# Altium schematic sheet TMC2160_Driver.SchDoc
size 420 x 297 mm; SheetNumber: 2; SheetTotal: 2
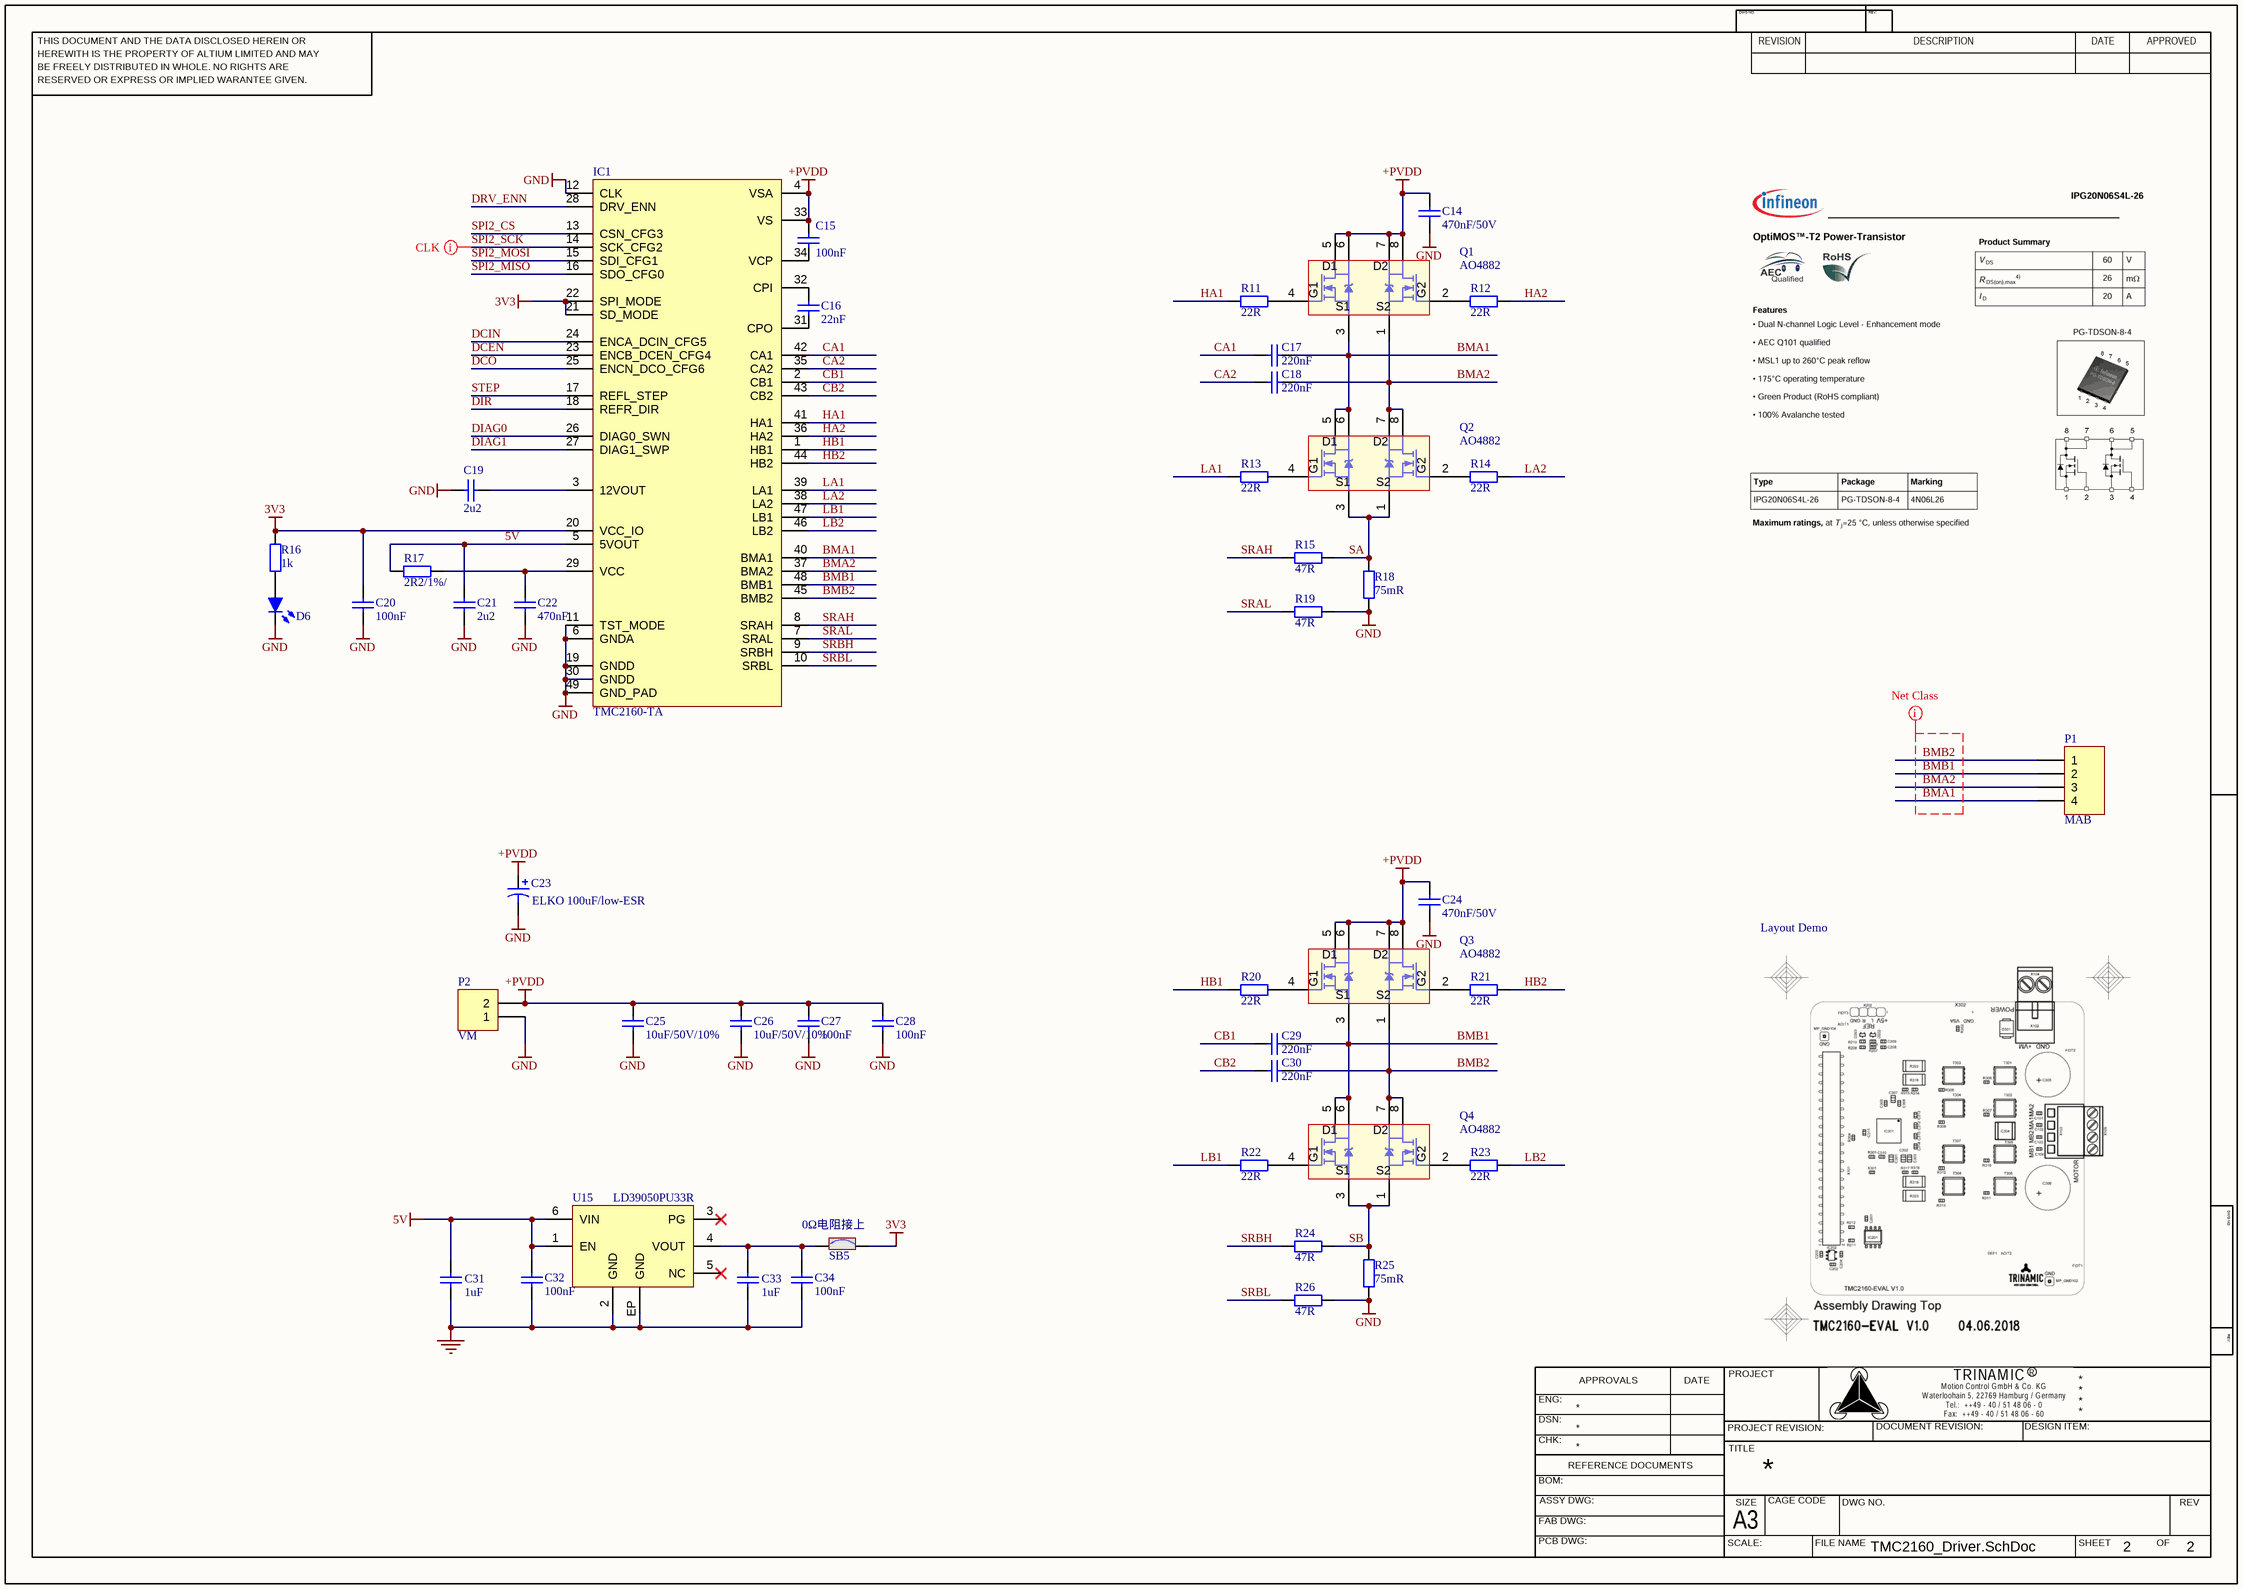
[diagram p0: TMC2160_Driver.SchDoc]

## Parts
C14  470nF/50V  [C0603]
C15  100nF  [C0603]
C16  22nF  [C0603]
C17  220nF  [C0603]
C18  220nF  [C0603]
C19  2u2  [C0603]
C20  100nF  [C0603]
C21  2u2  [C0603]
C22  470nF  [C0603]
C23  value ELKO 100uF/low-ESR  [EXT_POL_CAP]  (hidden comment: Cap Pol1)
C24  470nF/50V  [C0603]
C25  10uF/50V/10%  [C1206]
C26  10uF/50V/10%  [C1206]
C27  100nF  [C0603]
C28  100nF  [C0603]
C29  220nF  [C0603]
C30  220nF  [C0603]
C31  value 1uF  [C0603]
C32  value 100nF  [C0402]
C33  value 1uF  [C0603]
C34  value 100nF  [C0402]
D6  LED, Blue, SMD, 20mA, 2.8V, 465 nm  [LED_0603]  (value not drawn)
IC1  TMC2160-TA  [TMC5160_TSQFP50P900X900X120_HS-49L]
P1  MAB  [4_PIN_THT_1mm_hole]
P2  VM  [2_PIN_THT]
Q1  AO4882  [TDSON-8-4_IPG20N06S4L26]
Q2  AO4882  [TDSON-8-4_IPG20N06S4L26]
Q3  AO4882  [TDSON-8-4_IPG20N06S4L26]
Q4  AO4882  [TDSON-8-4_IPG20N06S4L26]
R11  Resistance: 22R  [R0603]  (hidden comment: 22R / 100mW / 1%)
R12  Resistance: 22R  [R0603]  (hidden comment: 22R / 100mW / 1%)
R13  Resistance: 22R  [R0603]  (hidden comment: 22R / 100mW / 1%)
R14  Resistance: 22R  [R0603]  (hidden comment: 22R / 100mW / 1%)
R15  Resistance: 47R  [R0603]  (hidden comment: 47R /  / 1%)
R16  1k  [R0603]
R17  2R2/1%/  [R0603]
R18  75mR  [R1206]
R19  Resistance: 47R  [R0603]  (hidden comment: 47R /  / 1%)
R20  Resistance: 22R  [R0603]  (hidden comment: 22R / 100mW / 1%)
R21  Resistance: 22R  [R0603]  (hidden comment: 22R / 100mW / 1%)
R22  Resistance: 22R  [R0603]  (hidden comment: 22R / 100mW / 1%)
R23  Resistance: 22R  [R0603]  (hidden comment: 22R / 100mW / 1%)
R24  Resistance: 47R  [R0603]  (hidden comment: 47R /  / 1%)
R25  75mR  [R1206]
R26  Resistance: 47R  [R0603]  (hidden comment: 47R /  / 1%)
SB5  (no value)  [SOLDER-BRIDGE_R0603-0R]
U15  value LD39050PU33R  [ICC_DFN6-EPAD_3X3_P095]

## Nets
3V3: C20.1 IC1.20(VCC_IO) IC1.21(SD_MODE) IC1.22(SPI_MODE) R16.1 SB5.2
5V: C21.1 C31.2 C32.2 IC1.5(5VOUT) R17.1 U15.1(EN) U15.6(VIN)
+PVDD: C14.1 C15.1 C23.1 C24.1 C25.2 C26.2 C27.1 C28.1 IC1.4(VSA) IC1.33(VS) P2.2 Q1.5(D1) Q1.6(D1) Q1.7(D2) Q1.8(D2) Q3.5(D1) Q3.6(D1) Q3.7(D2) Q3.8(D2)
GND: C14.2 C19.1 C20.2 C21.2 C22.2 C23.2 C24.2 C25.1 C26.1 C27.2 C28.2 C31.1 C32.1 C33.1 C34.1 D6.2(K) IC1.6(GNDA) IC1.11(TST_MODE) IC1.12(CLK) IC1.19(GNDD) IC1.30(GNDD) IC1.49(GND_PAD) P2.1 R18.2 R19.1 R25.2 R26.1 U15.2(GND) U15.EP(GND)
BMA1: C17.2 IC1.40(BMA1) P1.4 Q1.3(S1) Q2.5(D1) Q2.6(D1)
BMA2: C18.2 IC1.37(BMA2) P1.3 Q1.1(S2) Q2.7(D2) Q2.8(D2)
BMB1: C29.2 IC1.48(BMB1) P1.2 Q3.3(S1) Q4.5(D1) Q4.6(D1)
BMB2: C30.2 IC1.45(BMB2) P1.1 Q3.1(S2) Q4.7(D2) Q4.8(D2)
CA1: C17.1 IC1.42(CA1)
CA2: C18.1 IC1.35(CA2)
CB1: C29.1 IC1.2(CB1)
CB2: C30.1 IC1.43(CB2)
DCEN: IC1.23(ENCB_DCEN_CFG4)
DCIN: IC1.24(ENCA_DCIN_CFG5)
DCO: IC1.25(ENCN_DCO_CFG6)
DIAG0: IC1.26(DIAG0_SWN)
DIAG1: IC1.27(DIAG1_SWP)
DIR: IC1.18(REFR_DIR)
DRV_ENN: IC1.28(DRV_ENN)
HA1: IC1.41(HA1) R11.2
HA2: IC1.36(HA2) R12.1
HB1: IC1.1(HB1) R20.2
HB2: IC1.44(HB2) R21.1
LA1: IC1.39(LA1) R13.2
LA2: IC1.38(LA2) R14.1
LB1: IC1.47(LB1) R22.2
LB2: IC1.46(LB2) R23.1
SA: Q2.1(S2) Q2.3(S1) R15.1 R18.1
SB: Q4.1(S2) Q4.3(S1) R24.1 R25.1
SPI2_CS: IC1.13(CSN_CFG3)
SPI2_MISO: IC1.16(SDO_CFG0)
SPI2_MOSI: IC1.15(SDI_CFG1)
SPI2_SCK: IC1.14(SCK_CFG2)
SRAH: IC1.8(SRAH) R15.2
SRAL: IC1.7(SRAL) R19.2
SRBH: IC1.9(SRBH) R24.2
SRBL: IC1.10(SRBL) R26.2
STEP: IC1.17(REFL_STEP)
NetC15_2: C15.2 IC1.34(VCP)
NetC16_1: C16.1 IC1.31(CPO)
NetC16_2: C16.2 IC1.32(CPI)
NetC19_2: C19.2 IC1.3(12VOUT)
NetC22_1: C22.1 IC1.29(VCC) R17.2
NetC33_2: C33.2 C34.2 SB5.1 U15.4(VOUT)
NetD6_1: D6.1(A) R16.2
NetQ1_2: Q1.2(G2) R12.2
NetQ1_4: Q1.4(G1) R11.1
NetQ2_2: Q2.2(G2) R14.2
NetQ2_4: Q2.4(G1) R13.1
NetQ3_2: Q3.2(G2) R21.2
NetQ3_4: Q3.4(G1) R20.1
NetQ4_2: Q4.2(G2) R23.2
NetQ4_4: Q4.4(G1) R22.1

Not connected (* = marked no-connect by the designer): U15 3(PG)* 5(NC)*

## Layout directives
net class MotorPowerOut: BMA1, BMA2, BMB1, BMB2
mark named CLK: SPI2_SCK

## Notes on the sheet
- Layout Demo
- (near SB5) 0Ω电阻接上
- THIS DOCUMENT AND THE DATA DISCLOSED HEREIN OR
- HEREWITH IS THE PROPERTY OF ALTIUM LIMITED AND MAY
- DWG NO:
- REVISION
- REV:
- DESCRIPTION
- DATE
- APPROVED
- BE FREELY DISTRIBUTED IN WHOLE. NO RIGHTS ARE
- RESERVED OR EXPRESS OR IMPLIED WARANTEE GIVEN.
- ENG:
- APPROVALS
- PROJECT
- DSN:
- CHK:
- REFERENCE DOCUMENTS
- PROJECT REVISION:
- TITLE
- DOCUMENT REVISION:
- DESIGN ITEM:
- BOM:
- FAB DWG:
- PCB DWG:
- ASSY DWG:
- SCALE:
- A3
- SIZE
- CAGE CODE
- FILE NAME
- DWG NO.
- SHEET
- OF
- REV

## Library data of the parts
C14 = 0.47 µF, 50 V, ± 10%, X7R, C Series: SMD Multilayer Ceramic Capacitor, 0603 [1608 Metric], 0.47 µF, 50 V, ± 10%, X7R, C Series; MPN: C1608X7R1H474K080AC; Type: MLCC; VoltageRating: 50V; ComponentLinknDescription: Datasheet; MF: TDK; Capacitance: 470nF; Characteristic: *; ComponentLinknURL: *; Precision: 10%
C15 C20 = Capacitor: Ceramic capacitor; MPN: MC0603F104M500CT; Type: MLCC; Voltage rating: 50V; ComponentLinknDescription: Datasheet; MF: Multicomp; Precision: 20%; Characteristic: *; ComponentLinknURL: *; Capacitance: 100nF
C16 = Capacitor: Ceramic capacitor; MPN: MC0603B223K500CT; Type: MLCC; Voltage rating: 50V; ComponentLinknDescription: Datasheet; MF: Multicomp; Precision: 20%; Characteristic: *; ComponentLinknURL: *; Capacitance: 22nF
C17 C18 C29 C30 = 0.22 µF, 50 V, ± 10%, X7R: SMD Multilayer Ceramic Capacitor, 0603 [1608 Metric], 0.22 µF, 50 V, ± 10%, X7R, GCM Series; MPN: GCM188R71H224KA64D; Type: MLCC; Voltage rating: 50V; ComponentLinknDescription: Datasheet; MF: MURATA; Characteristic: *; ComponentLinknURL: *; Capacitance: 220nF; Precision: 10%
C19 C21 = 2.2 µF, 25 V, ± 10%, X5R, GRM Series: SMD Multilayer Ceramic Capacitor, 0603 [1608 Metric], 2.2 µF, 25 V, ± 10%, X5R, GRM Series; MPN: GRM188R61E225KA12D; Type: MLCC; Voltage rating: 50V; ComponentLinknDescription: Datasheet; MF: MURATA; Characteristic: *; ComponentLinknURL: *; Capacitance: 2u2; Precision: 10%
C22 = Capacitor: Ceramic capacitor; MPN: MC0603X474K160CT; Type: MLCC; Voltage rating: 16V; ComponentLinknDescription: Datasheet; MF: Multicomp; Precision: 10%; Characteristic: *; ComponentLinknURL: *; Capacitance: 470nF
C23 = Cap Pol1: Polarized Capacitor (Radial); Published: 8-Jun-2000; LatestRevisionDate: 17-Jul-2002; LatestRevisionNote: Re-released for DXP Platform.; PackageReference: RB7.6-15; Publisher: Altium Limited; PackageDescription: Polarized Capacitor (Radial); 2 Leads
C24 = 0.47 µF, 50 V, ± 10%, X7R, C Series: SMD Multilayer Ceramic Capacitor, 0603 [1608 Metric], 0.47 µF, 50 V, ± 10%, X7R, C Series; MPN: C1608X7R1H474K080AC; Type: MLCC; ComponentLinknDescription: Datasheet; MF: TDK; Capacitance: 470nF; VoltageRating: 50V; Characteristic: *; ComponentLinknURL: *; Precision: 10%
C25 C26 = 10 µF, 50 V, ± 20%, X5R, GRM Series: SMD Multilayer Ceramic Capacitor, 1206 [3216 Metric], 10 µF, 50 V, ± 20%, X5R, GRM Series; MPN: GRM31CR61H106MA12L; Type: MLCC; VoltageRating: 50V; ComponentLinknDescription: Datasheet; MF: MURATA; Capacitance: 10uF; Precision: 10%; Characteristic: *; ComponentLinknURL: *
C27 C28 = Capacitor: Ceramic capacitor; Manufacturer: Multicomp; MPN: MC0603F104M500CT; Type: MLCC; Voltage rating: 50V; ComponentLinknDescription: Datasheet; Precision: 20%; Characteristic: *; ComponentLinknURL: *; Capacitance: 100nF
C31 C33 = MCD-00010: Capacitor, MLCC, 1uF, 16V, X5R, 10%, 0603, T=0,8mm; Manufacturer_Part_Number: CC0603KRX5R7BB105; Manufacturer: YAGEO; Provided_By: Subcon; Initial_Board_Reference: MB1274; Internal_Part_Number: MCD-00010; Status: Released; Package: C0603; ComponentLink1Description: Yageo_Capacitor_X5R-series.pdf; ECCN_US: n/a; ECCN_EU: n/a; Part_Type: Capacitor; ComponentLink1URL: http://tunmcdsvn.tun.st.com/Component_Datasheet_Library/Trunk/Capacitors/Yageo_Multilayer_capacitor_X5R_series_100pF_to_100uF
C32 C34 = MCD-00102: Capacitor, MLCC, 100nF, 16V, X7R, 10%, 0402, T=0,5mm; Manufacturer_Part_Number: CC0402KRX7R7BB104; Manufacturer: YAGEO; Provided_By: Subcon; Initial_Board_Reference: MB1262; Internal_Part_Number: MCD-00102; Status: Released; Package: C0402; ComponentLink1Description: Yageo_Capacitor_X7R-series.pdf; ECCN_US: n/a; ECCN_EU: n/a; Part_Type: Capacitor; ComponentLink1URL: http://tunmcdsvn.tun.st.com/Component_Datasheet_Library/Trunk/Capacitors/Yageo_Multilayer_Capacitor_X7R_series_100pF_to_22uF
D6 = LED, Blue, SMD, 20mA, 2.8V, 465 nm: MPN: LTST-C191TBKT-5A; MF: Lite-On; Current rating: 20mA; Colour: Blue
IC1 = TMC2160-TA: Manufacturer: TRINAMIC; Geometry.Height: 1,2mm; Distributor#1: Digikey; Distributor#2: *; MPN: TMC2160-TA; MF: TRINAMIC
P1 = Wire-To-Board Connector, 2.5 mm, 4 Contacts, Header, EH Series, Through Hole, 1 Rows: MPN: B4B-EH-A; MF: JST (JAPAN SOLDERLESS TERMINALS); Fitted: Not fitted
P2 = Header 2: Header, 2-Pin; Fitted: Not fitted; LatestRevisionDate: 17-Jul-2002; LatestRevisionNote: Re-released for DXP Platform.; Publisher: Altium Limited; ComponentClass: Pinheader
Q1-Q4 = AO4882 MOSFET 2N-CH 40V 8A 8SOIC: Mosfet Array 2 N-Channel (Dual) 40V 8A 2W Surface Mount 8-SOIC; MF: Alpha & Omega Semiconductor Inc.; MPN: AO4882
R11-R14 R20-R23 = 22 ohm, 50 V, 0603 [1608 Metric], 100 mW, ± 1%, MCWR Series: SMD Chip Resistor, Thick Film, 22 ohm, 50 V, 0603 [1608 Metric], 100 mW, ± 1%, MCWR Series; MPN: MCWR06X22R0FTLV; Temp coefficient: *ppm; MF: MULTICOMP; Precision: 1%; PowerRating: 100mW; Manufacturer: *; ComponentLinknURL: *
R15 R19 R24 R26 = 47 ohm, 75 V, 0603 [1608 Metric], 100 mW, ± 1%, MCSR 06 Series: SMD Chip Resistor, Ceramic, 47 ohm, 75 V, 0603 [1608 Metric], 100 mW, ± 1%, MCSR 06 Series; MPN: MCSR06X47R0FTL; Temp coefficient: *ppm; MF: MULTICOMP; Precision: 1%; Manufacturer: *; ComponentLinknURL: *
R16 = 1 kohm, 50 V, 0603 [1608 Metric], 63 mW, ± 1%, MC Series: MPN: MC0063W060311K; VoltageRating: 50V; Temp coefficient: *ppm; PowerRating: 63mW; MF: MULTICOMP; Precision: 1%; Manufacturer: *; ComponentLinknURL: *; Resistance: 1k
R17 = Resistor: MPN: MC0063W060312R2; Precision: 1%; Voltage rating: *V; Temp coefficient: *ppm; Power rating: *mW; ComponentLinknDescription: Datasheet; Resistance: 2R2; MF: Multicomp; ComponentLinknURL: *
R18 R25 = R_SENS, 0.075 ohm, 1206, 1W, ± 1%, ERJ Series: SMD Chip Resistor, Thick Film, Current Sense Resistors - SMD 1W 0.075ohm 1%; MPN: ERJ-8BWFR075V; VoltageRating: 50V; Temp coefficient: *ppm; MF: Panasonic Electronic Components; Precision: 1%; PowerRating: 1W; Resistance: 75mR
SB5 = MCD-00071: Solder Bridge ON; Part_Type: Mechanical; Manufacturer_Part_Number: RC0603JR-070RL; Manufacturer: YAGEO; Provided_By: SUBCO; Internal_Part_Number: MCD-00071; ECCN_US: n/a; ECCN_EU: n/a; Status: Released; Package: SB0603; ComponentLink1Description: Datasheet; ComponentLink1URL: http://tunmcdsvn.tun.st.com/Component_Datasheet_Library/Trunk/Resistors/Yageo_Resistor_RC0603-series
U15 = MCD-00215: Low quiescent current and low noise voltage regulators; Manufacturer: STMICROELECTRONICS; Part_Type: IC; BMS_Part_Number: 9176126; ECCN_US: EAR99; ECCN_EU: NEC; Provided_By: SUBCO with ST control; Internal_Part_Number: MCD-00215; Manufacturer_Part_Number: LD39050PU33R; Status: Released; ComponentLink1Description: Datasheet; ComponentLink1URL: http://tunmcdsvn.tun.st.com/Component_Datasheet_Library/Trunk/IC/STM_LDO_LD39050PU; Package: DFN6 3x3mm